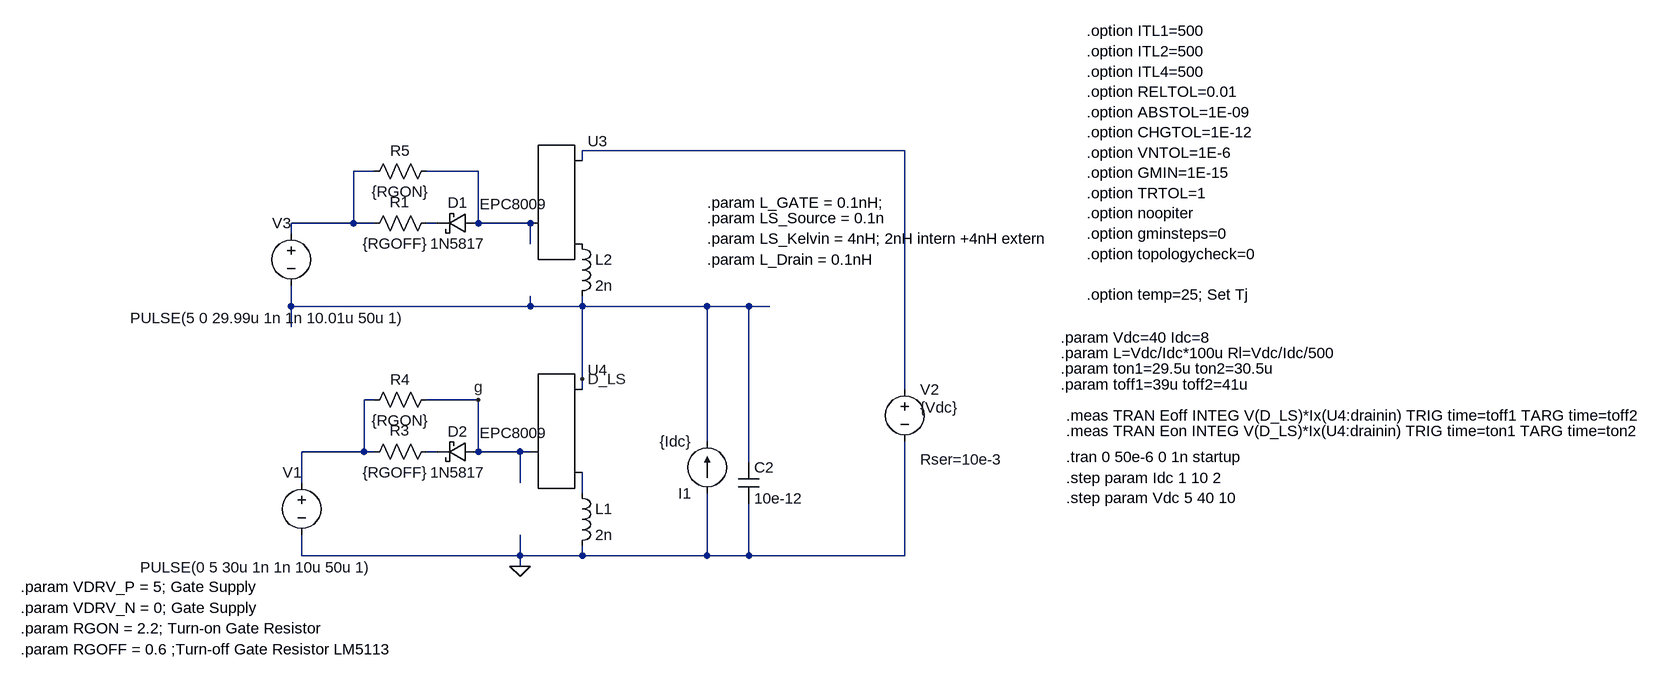
[diagram p0: schematic DoublePulseTester_EPC8009_sync.asc]
DoublePulseTester_EPC8009_sync.asc, the LTspice schematic file:
Version 4
SHEET 1 1812 1280
WIRE 192 336 -304 336
WIRE -304 352 -304 336
WIRE -624 368 -656 368
WIRE -464 368 -544 368
WIRE -656 448 -656 368
WIRE -656 448 -752 448
WIRE -624 448 -656 448
WIRE -528 448 -544 448
WIRE -464 448 -464 368
WIRE -384 448 -464 448
WIRE -752 464 -752 448
WIRE -384 480 -384 448
WIRE -752 576 -752 544
WIRE -384 576 -384 560
WIRE -384 576 -752 576
WIRE -304 576 -304 560
WIRE -304 576 -384 576
WIRE -112 576 -304 576
WIRE -48 576 -112 576
WIRE -16 576 -48 576
WIRE -752 608 -752 576
WIRE -304 688 -304 576
WIRE -304 704 -304 688
WIRE 192 704 192 336
WIRE -624 720 -640 720
WIRE -464 720 -544 720
WIRE -112 784 -112 576
WIRE -640 800 -640 720
WIRE -640 800 -736 800
WIRE -624 800 -640 800
WIRE -528 800 -544 800
WIRE -464 800 -464 720
WIRE -400 800 -464 800
WIRE -384 800 -400 800
WIRE -48 816 -48 576
WIRE -736 848 -736 800
WIRE -400 848 -400 800
WIRE -304 864 -304 832
WIRE -736 960 -736 928
WIRE -400 960 -400 928
WIRE -400 960 -736 960
WIRE -304 960 -304 944
WIRE -304 960 -400 960
WIRE -112 960 -112 864
WIRE -112 960 -304 960
WIRE -48 960 -48 880
WIRE -48 960 -112 960
WIRE 192 960 192 784
WIRE 192 960 -48 960
WIRE -400 976 -400 960
FLAG -400 976 0
FLAG -464 720 g
FLAG -304 688 D_LS
SYMBOL voltage -736 832 R0
WINDOW 3 -248 146 Left 2
WINDOW 123 0 0 Left 2
WINDOW 39 0 0 Left 2
WINDOW 0 -29 0 Left 2
SYMATTR Value PULSE(0 5 30u 1n 1n 10u 50u 1)
SYMATTR InstName V1
SYMBOL voltage 192 688 R0
WINDOW 123 0 0 Left 2
WINDOW 39 24 124 Left 2
WINDOW 3 24 44 Left 2
SYMATTR SpiceLine Rser=10e-3
SYMATTR Value {Vdc}
SYMATTR InstName V2
SYMBOL current -112 864 R180
WINDOW 123 0 0 Left 2
WINDOW 39 0 0 Left 2
SYMATTR InstName I1
SYMATTR Value {Idc}
SYMBOL cap -64 816 R0
SYMATTR InstName C2
SYMATTR Value 10e-12
SYMBOL EPCGaN -384 448 R0
WINDOW 3 -78 -29 Left 2
SYMATTR Value EPC8009
SYMATTR InstName U3
SYMBOL EPCGaN -384 800 R0
WINDOW 3 -78 -29 Left 2
SYMATTR Value EPC8009
SYMATTR InstName U4
SYMBOL res -528 784 R90
WINDOW 0 -1 57 VBottom 2
WINDOW 3 32 63 VTop 2
SYMATTR InstName R3
SYMATTR Value {RGOFF}
SYMBOL res -640 736 R270
WINDOW 0 32 56 VTop 2
WINDOW 3 0 56 VBottom 2
SYMATTR InstName R4
SYMATTR Value {RGON}
SYMBOL voltage -752 448 R0
WINDOW 3 -248 146 Left 2
WINDOW 123 0 0 Left 2
WINDOW 39 0 0 Left 2
WINDOW 0 -29 0 Left 2
SYMATTR Value PULSE(5 0 29.99u 1n 1n 10.01u 50u 1)
SYMATTR InstName V3
SYMBOL res -528 432 R90
WINDOW 0 -1 57 VBottom 2
WINDOW 3 32 63 VTop 2
SYMATTR InstName R1
SYMATTR Value {RGOFF}
SYMBOL res -640 384 R270
WINDOW 0 32 56 VTop 2
WINDOW 3 0 56 VBottom 2
SYMATTR InstName R5
SYMATTR Value {RGON}
SYMBOL schottky -464 432 R90
WINDOW 0 0 32 VBottom 2
WINDOW 3 32 32 VTop 2
SYMATTR InstName D1
SYMATTR Value 1N5817
SYMATTR Description Diode
SYMATTR Type diode
SYMBOL schottky -464 784 R90
WINDOW 0 0 32 VBottom 2
WINDOW 3 32 32 VTop 2
SYMATTR InstName D2
SYMATTR Value 1N5817
SYMATTR Description Diode
SYMATTR Type diode
SYMBOL ind -320 848 R0
SYMATTR InstName L1
SYMATTR Value 2n
SYMBOL ind -320 464 R0
SYMATTR InstName L2
SYMATTR Value 2n
TEXT 440 808 Left 2 !.tran 0 50e-6 0 1n startup
TEXT 440 744 Left 2 !.meas TRAN Eoff INTEG V(D_LS)*Ix(U4:drainin) TRIG time=toff1 TARG time=toff2
TEXT 432 696 Left 2 !.param toff1=39u toff2=41u
TEXT 440 768 Left 2 !.meas TRAN Eon INTEG V(D_LS)*Ix(U4:drainin) TRIG time=ton1 TARG time=ton2
TEXT 432 672 Left 2 !.param ton1=29.5u ton2=30.5u
TEXT 432 648 Left 2 !.param L=Vdc/Idc*100u Rl=Vdc/Idc/500
TEXT 432 624 Left 2 !.param Vdc=40 Idc=8
TEXT 440 840 Left 2 !.step param Idc 1 10 2\n.step param Vdc 5 40 10
TEXT -112 440 Left 2 !.param LS_Source = 0.1n
TEXT -112 504 Left 2 !.param L_Drain = 0.1nH
TEXT -1168 1008 Left 2 !.param VDRV_P = 5; Gate Supply
TEXT -1168 1040 Left 2 !.param VDRV_N = 0; Gate Supply
TEXT -112 472 Left 2 !.param LS_Kelvin = 4nH; 2nH intern +4nH extern
TEXT -112 416 Left 2 !.param L_GATE = 0.1nH;
TEXT 472 152 Left 2 !.option ITL1=500\n.option ITL2=500\n.option ITL4=500\n.option RELTOL=0.01\n.option ABSTOL=1E-09\n.option CHGTOL=1E-12\n.option VNTOL=1E-6\n.option GMIN=1E-15\n.option TRTOL=1\n.option noopiter\n.option gminsteps=0\n.option topologycheck=0\n \n.option temp=25; Set Tj
TEXT -1168 1104 Left 2 !.param RGOFF = 0.6 ;Turn-off Gate Resistor LM5113
TEXT -1168 1072 Left 2 !.param RGON = 2.2; Turn-on Gate Resistor

The netlist it stands for:
* DoublePulseTester_EPC8009_sync.asc
V1 N005 0 PULSE(0 5 30u 1n 1n 10u 50u 1)
V2 N001 0 {Vdc} Rser=10e-3
I1 0 D_LS {Idc}
C2 D_LS 0 10e-12
XU3 N003 N001 P001 EPC8009
XU4 g D_LS N007 EPC8009
R3 N006 N005 {RGOFF}
R4 N005 g {RGON}
V3 N002 D_LS PULSE(5 0 29.99u 1n 1n 10.01u 50u 1)
R1 N004 N002 {RGOFF}
R5 N002 N003 {RGON}
D1 N003 N004 1N5817
D2 g N006 1N5817
L1 N007 0 2n
L2 P001 D_LS 2n
.model D D
.lib standard.dio
.tran 0 50e-6 0 1n startup
.meas TRAN Eoff INTEG V(D_LS)*Ix(U4:drainin) TRIG time=toff1 TARG time=toff2
.param toff1=39u toff2=41u
.meas TRAN Eon INTEG V(D_LS)*Ix(U4:drainin) TRIG time=ton1 TARG time=ton2
.param ton1=29.5u ton2=30.5u
.param L=Vdc/Idc*100u Rl=Vdc/Idc/500
.param Vdc=40 Idc=8
.step param Idc 1 10 2
.step param Vdc 5 40 10
.param LS_Source = 0.1n
.param L_Drain = 0.1nH
.param VDRV_P = 5; Gate Supply
.param VDRV_N = 0; Gate Supply
.param LS_Kelvin = 4nH; 2nH intern +4nH extern
.param L_GATE = 0.1nH;
.option ITL1=500
.option ITL2=500
.option ITL4=500
.option RELTOL=0.01
.option ABSTOL=1E-09
.option CHGTOL=1E-12
.option VNTOL=1E-6
.option GMIN=1E-15
.option TRTOL=1
.option noopiter
.option gminsteps=0
.option topologycheck=0
.option temp=25; Set Tj
.param RGOFF = 0.6 ;Turn-off Gate Resistor LM5113
.param RGON = 2.2; Turn-on Gate Resistor
.backanno
.end